# Altium project COMS0005_Coms_Test_Board.PrjPCB
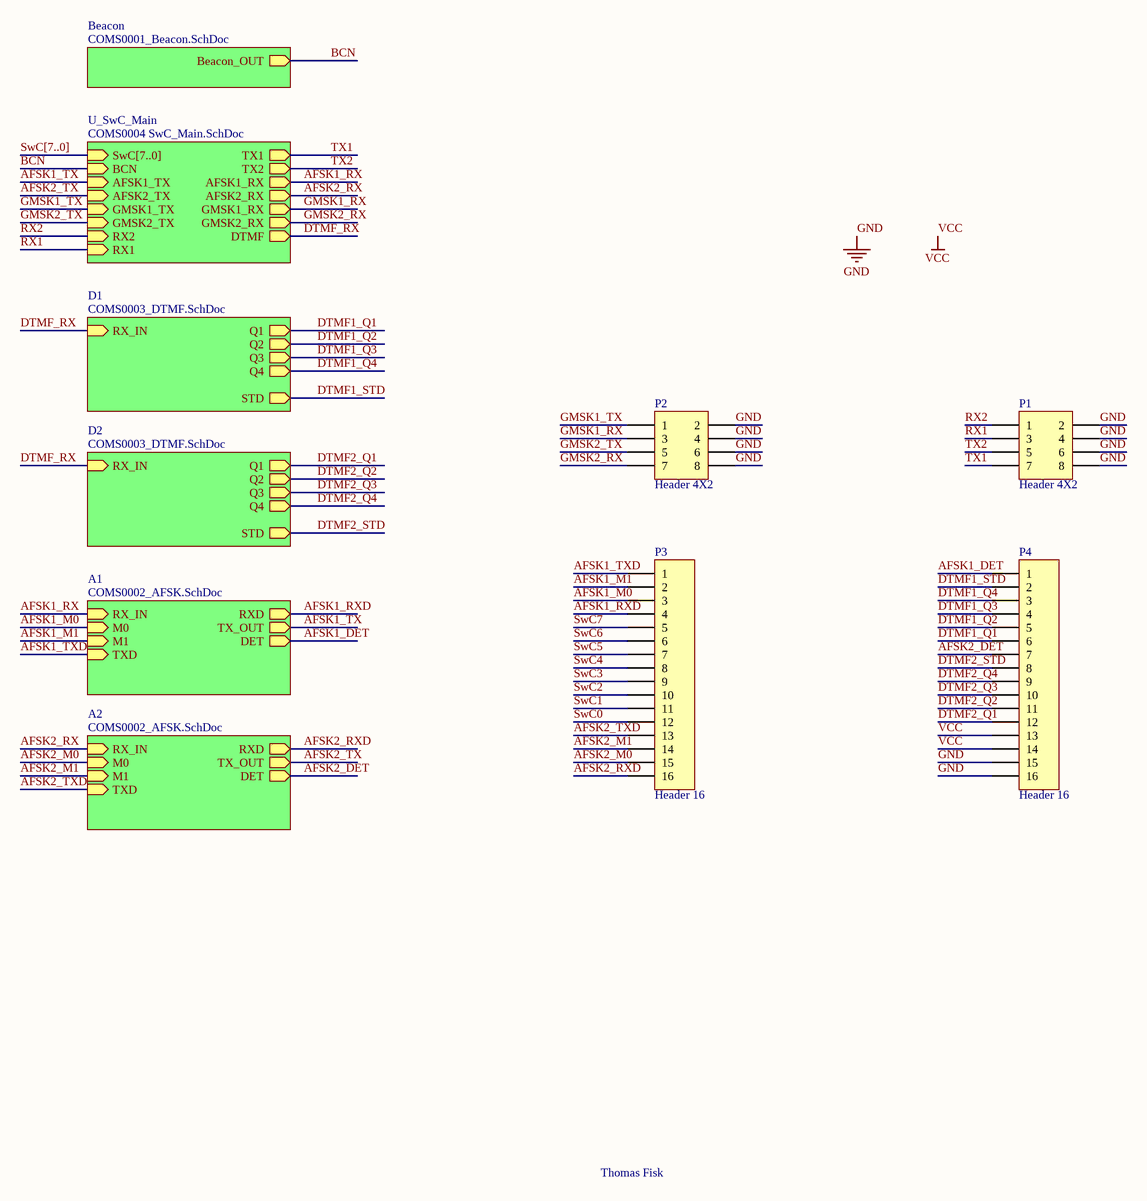
[diagram p0: COMS0010_Comms_Test_Board.SchDoc]
5 sheets, 60 parts. Net scope: hierarchical (ports join the sheet entries above them; power ports are global).
Sheets:
  COMS0010_Comms_Test_Board.SchDoc
    Beacon = COMS0001_Beacon.SchDoc
    U_SwC_Main = COMS0004 SwC_Main.SchDoc
    A1 = COMS0002_AFSK.SchDoc
    A2 = COMS0002_AFSK.SchDoc
    D1 = COMS0003_DTMF.SchDoc
    D2 = COMS0003_DTMF.SchDoc

## Sheet COMS0010_Comms_Test_Board.SchDoc: BLUEsat Communications Test Board
size A3; DrawnBy: Thomas Fisk; Engineer: T. FISK; Organization: BLUEsat Project; Address1: Room 419; Address2: School of EE&T; Address3: UNSW, NSW 2052; Address4: Australia; DocumentNumber: COMS0005; SheetNumber: 1; SheetTotal: 1; Description: Test board for communications subsystem.; Version: 1.0

### Parts
P1  Header 4X2  [HDR2X4]
P2  Header 4X2  [HDR2X4]
P3  Header 16  [HDR1X16]
P4  Header 16  [HDR1X16]

### Sub-sheets
A1 = COMS0002_AFSK.SchDoc: RX_IN (in), M0 (in), M1 (in), TXD (in), RXD (out), TX_OUT (out), DET (out)
A2 = COMS0002_AFSK.SchDoc: RX_IN (in), M0 (in), M1 (in), TXD (in), RXD (out), TX_OUT (out), DET (out)
Beacon = COMS0001_Beacon.SchDoc: Beacon_OUT (out)
D1 = COMS0003_DTMF.SchDoc: Q1 (out), RX_IN (in), STD (out), Q2 (out), Q3 (out), Q4 (out)
D2 = COMS0003_DTMF.SchDoc: Q1 (out), RX_IN (in), STD (out), Q2 (out), Q3 (out), Q4 (out)
U_SwC_Main = COMS0004 SwC_Main.SchDoc: SwC[7..0] (in), BCN (in), AFSK1_TX (in), AFSK2_TX (in), GMSK1_TX (in), GMSK2_TX (in), TX1 (out), TX2 (out), RX2 (in), RX1 (in), AFSK1_RX (out), AFSK2_RX (out), GMSK1_RX (out), GMSK2_RX (out), DTMF (out)

### Nets
GND: P1.2 P1.4 P1.6 P1.8 P2.2 P2.4 P2.6 P2.8 P4.15 P4.16
VCC: P4.13 P4.14
AFSK1_DET: P4.1 ; sheet A1/DET
AFSK1_M0: P3.3 ; sheet A1/M0
AFSK1_M1: P3.2 ; sheet A1/M1
AFSK1_RX: sheet U_SwC_Main/AFSK1_RX, sheet A1/RX_IN
AFSK1_RXD: P3.4 ; sheet A1/RXD
AFSK1_TX: sheet U_SwC_Main/AFSK1_TX, sheet A1/TX_OUT
AFSK1_TXD: P3.1 ; sheet A1/TXD
AFSK2_DET: P4.7 ; sheet A2/DET
AFSK2_M0: P3.15 ; sheet A2/M0
AFSK2_M1: P3.14 ; sheet A2/M1
AFSK2_RX: sheet U_SwC_Main/AFSK2_RX, sheet A2/RX_IN
AFSK2_RXD: P3.16 ; sheet A2/RXD
AFSK2_TX: sheet U_SwC_Main/AFSK2_TX, sheet A2/TX_OUT
AFSK2_TXD: P3.13 ; sheet A2/TXD
BCN: sheet Beacon/Beacon_OUT, sheet U_SwC_Main/BCN
DTMF1_Q1: P4.6 ; sheet D1/Q1
DTMF1_Q2: P4.5 ; sheet D1/Q2
DTMF1_Q3: P4.4 ; sheet D1/Q3
DTMF1_Q4: P4.3 ; sheet D1/Q4
DTMF1_STD: P4.2 ; sheet D1/STD
DTMF2_Q1: P4.12 ; sheet D2/Q1
DTMF2_Q2: P4.11 ; sheet D2/Q2
DTMF2_Q3: P4.10 ; sheet D2/Q3
DTMF2_Q4: P4.9 ; sheet D2/Q4
DTMF2_STD: P4.8 ; sheet D2/STD
DTMF_RX: sheet U_SwC_Main/DTMF, sheet D1/RX_IN, sheet D2/RX_IN
GMSK1_RX: P2.3 ; sheet U_SwC_Main/GMSK1_RX
GMSK1_TX: P2.1 ; sheet U_SwC_Main/GMSK1_TX
GMSK2_RX: P2.7 ; sheet U_SwC_Main/GMSK2_RX
GMSK2_TX: P2.5 ; sheet U_SwC_Main/GMSK2_TX
RX1: P1.3 ; sheet U_SwC_Main/RX1
RX2: P1.1 ; sheet U_SwC_Main/RX2
SwC0: P3.12
SwC1: P3.11
SwC2: P3.10
SwC3: P3.9
SwC4: P3.8
SwC5: P3.7
SwC6: P3.6
SwC7: P3.5
TX1: P1.7 ; sheet U_SwC_Main/TX1
TX2: P1.5 ; sheet U_SwC_Main/TX2

### Buses and harness runs
bus SwC[7..0] = sheet U_SwC_Main/SwC[7..0]

### Notes on the sheet
- Thomas Fisk
- Title
- Description:
- Size:
- Author:
- Date:
- A3
- Time:
- Version
- Sheet:
- Drawing No.:
- of
- File:

### Library data of the parts
P1 P2 = Header 4X2: Header, 4-Pin, Dual row; LatestRevisionDate: 17-Jul-2002; LatestRevisionNote: Re-released for DXP Platform.; Publisher: Altium Limited
P3 P4 = Header 16: Header, 16-Pin; LatestRevisionDate: 17-Jul-2002; LatestRevisionNote: Re-released for DXP Platform.; Publisher: Altium Limited

## Sheet COMS0001_Beacon.SchDoc: BLUEsat Beacon
size A3; Author: Daniel Jedrychowski; Engineer: D. JEDRYCHOWSKI; Organization: BLUEsat Project; Address1: Room 419; Address2: School of EE&T; Address3: UNSW, NSW 2052; Address4: Australia; DocumentNumber: COMS0001; SheetNumber: 1; SheetTotal: 1; Description: Morse code continuous wave beacon based on EPROM; Version: 1.1
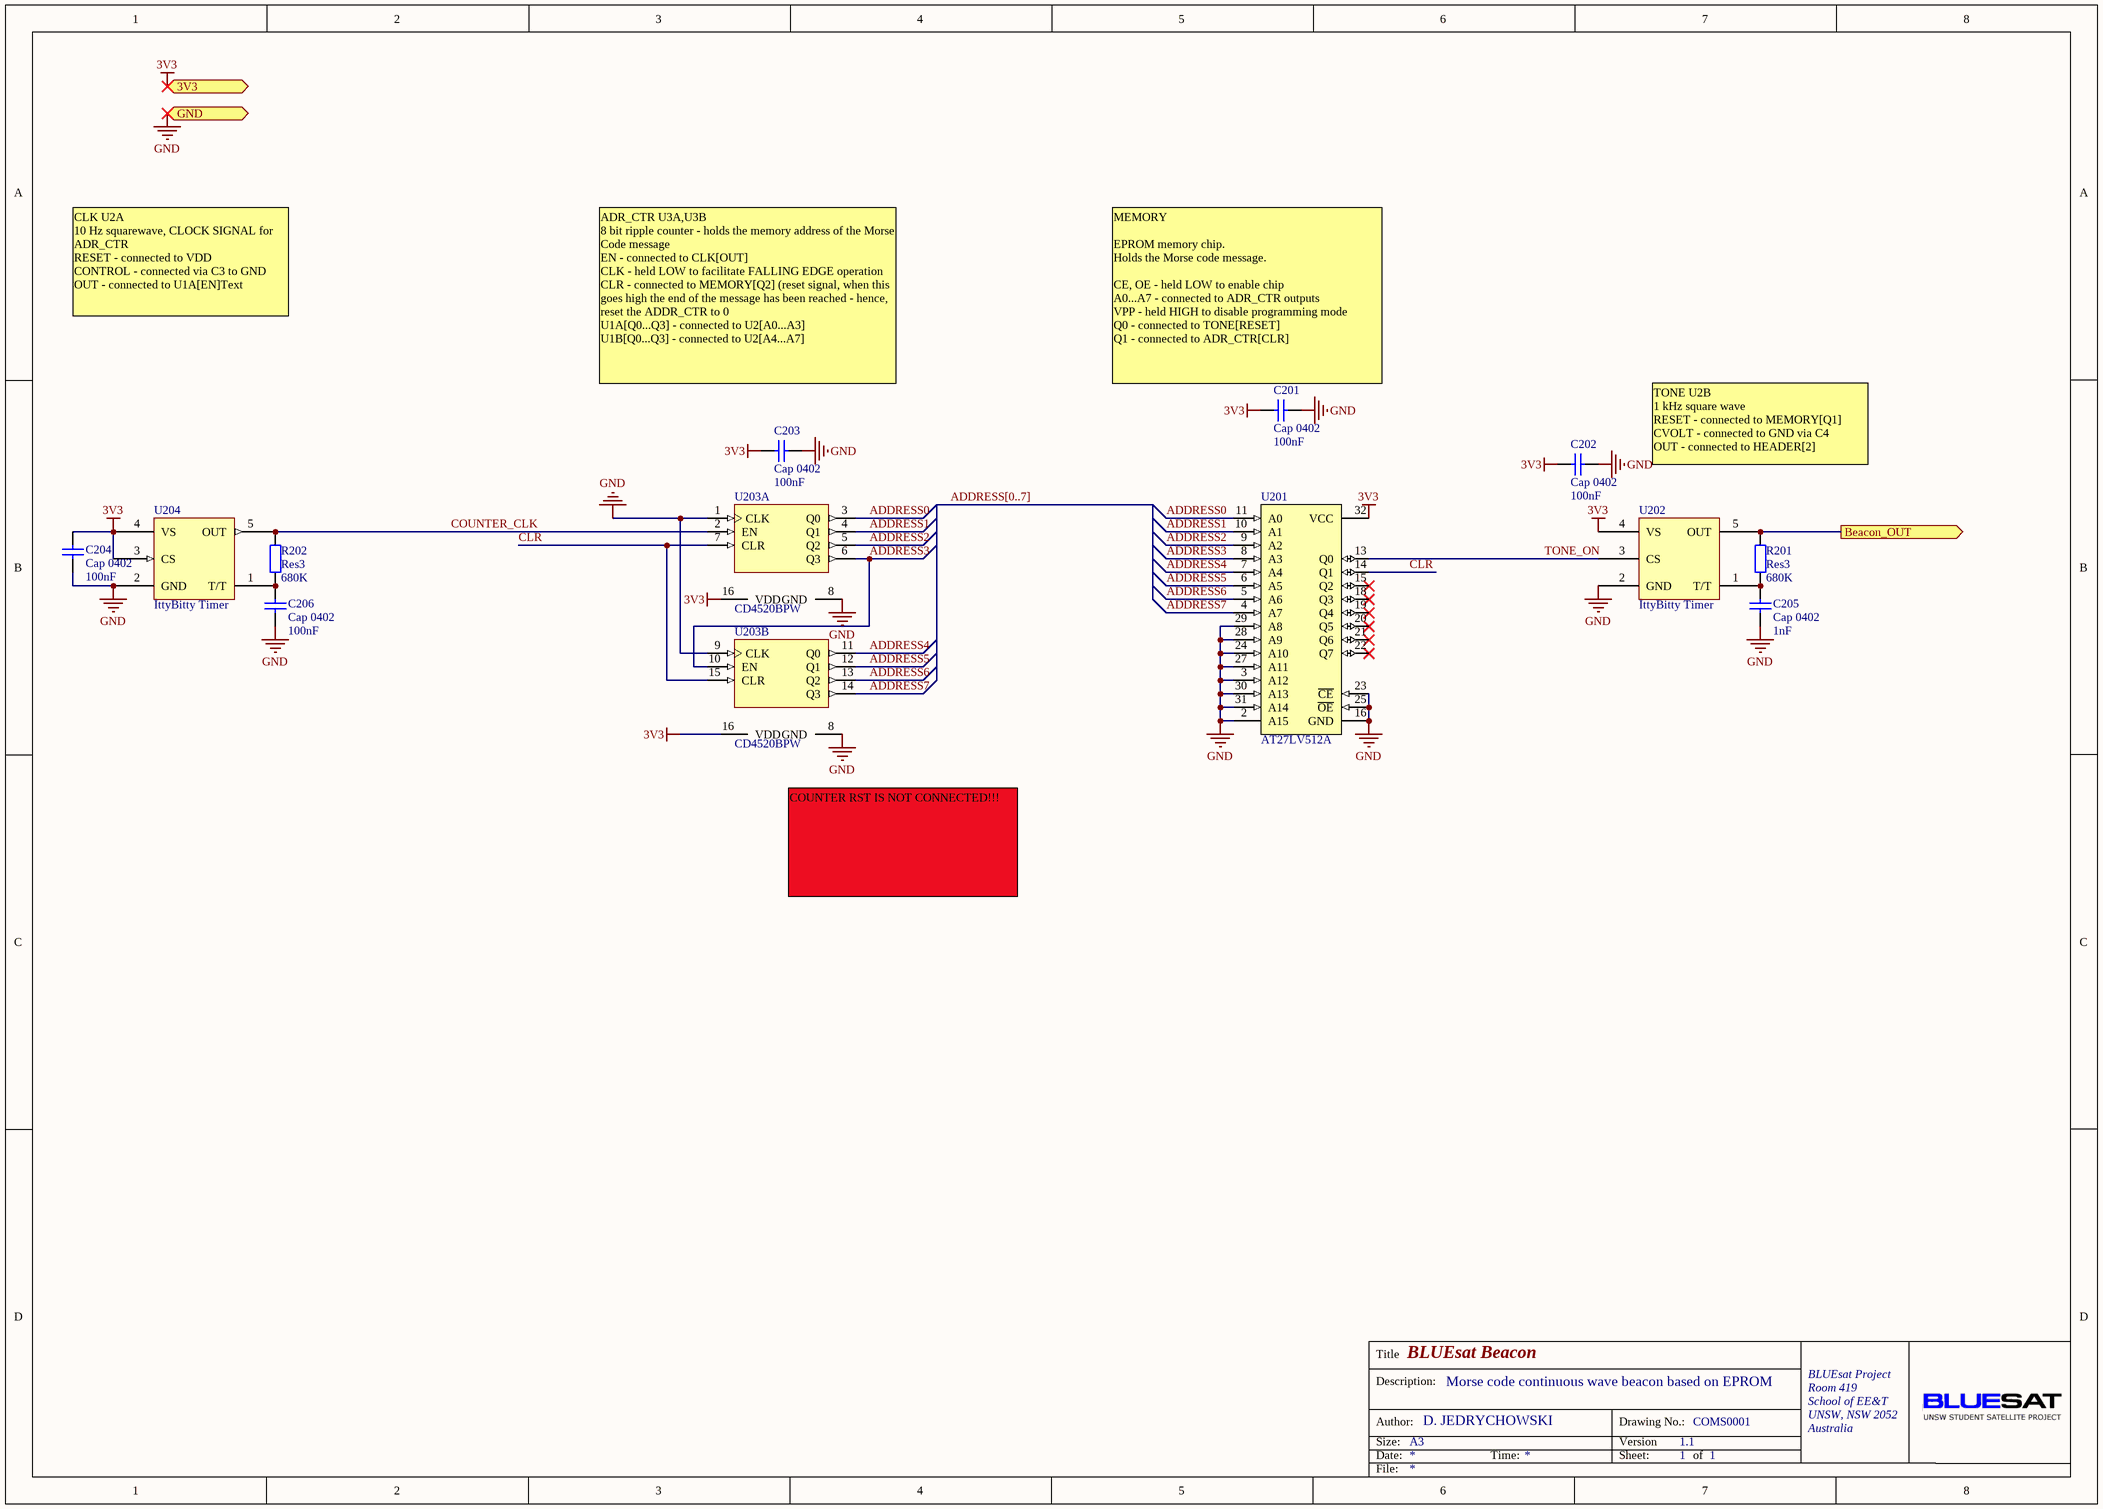
[diagram p1: COMS0001_Beacon.SchDoc]

### Parts
C201  Cap 0402  value 100nF  [CAPC1005X06L]
C202  Cap 0402  value 100nF  [CAPC1005X06L]
C203  Cap 0402  value 100nF  [CAPC1005X06L]
C204  Cap 0402  value 100nF  [CAPC1005X06L]
C205  Cap 0402  value 1nF  [CAPC1005X06L]
C206  Cap 0402  value 100nF  [CAPC1005X06L]
R201  Res3  value 680K  [RESC1005X06L]
R202  Res3  value 680K  [RESC1005X06L]
U201  AT27LV512A  [PLCC7*9]
U202  IttyBitty Timer  [SOT23-5]
U203  CD4520BPW  [TSSOP16]  (parts A,B of 2)
U204  IttyBitty Timer  [SOT23-5]

### Ports
3V3 (in), Beacon_OUT (out), GND (in)

### Nets
3V3: C201.1 C202.1 C203.1 C204.2 U201.32(VCC) U202.4(VS) U203.16(VDD) U204.3(CS) U204.4(VS) ; port 3V3
GND: C201.2 C202.2 C203.2 C204.1 C205.1 C206.1 U201.2(A15) U201.3(A12) U201.16(GND) U201.23(~{CE}) U201.24(A10) U201.25(~{OE}) U201.27(A11) U201.28(A9) U201.29(A8) U201.30(A13) U201.31(A14) U202.2(GND) U203.1(CLK) U203.8(GND) U203.9(CLK) U204.2(GND) ; port GND
ADDRESS0: U201.11(A0) U203.3(Q0)
ADDRESS1: U201.10(A1) U203.4(Q1)
ADDRESS2: U201.9(A2) U203.5(Q2)
ADDRESS3: U201.8(A3) U203.6(Q3) U203.10(EN)
ADDRESS4: U201.7(A4) U203.11(Q0)
ADDRESS5: U201.6(A5) U203.12(Q1)
ADDRESS6: U201.5(A6) U203.13(Q2)
ADDRESS7: U201.4(A7) U203.14(Q3)
BCN: R201.1 U202.5(OUT) ; port Beacon_OUT
CLR: U201.14(Q1) U203.7(CLR) U203.15(CLR)
COUNTER_CLK: R202.1 U203.2(EN) U204.5(OUT)
TONE_ON: U201.13(Q0) U202.3(CS)
NetC205_2: C205.2 R201.2 U202.1(T/T)
NetC206_2: C206.2 R202.2 U204.1(T/T)

Not connected (* = marked no-connect by the designer): U201 15(Q2)* 18(Q3)* 19(Q4)* 20(Q5)* 21(Q6)* 22(Q7)*

### Buses and harness runs
bus ADDRESS[0..7]

### Notes on the sheet
- CLK U2A
  10 Hz squarewave, CLOCK SIGNAL for ADR_CTR
  RESET - connected to VDD
  CONTROL - connected via C3 to GND
  OUT - connected to U1A[EN]Text
- ADR_CTR U3A,U3B
  8 bit ripple counter - holds the memory address of the Morse Code message
  EN - connected to CLK[OUT]
  CLK - held LOW to facilitate FALLING EDGE operation
  CLR - connected to MEMORY[Q2] (reset signal, when this goes high the end of the message has been reached - hence, reset the ADDR_CTR to 0
  U1A[Q0...Q3] - connected to U2[A0...A3]
  U1B[Q0...Q3] - connected to U2[A4...A7]
- (near C201) MEMORY
  EPROM memory chip.
  Holds the Morse code message.
  CE, OE - held LOW to enable chip
  A0...A7 - connected to ADR_CTR outputs
  VPP - held HIGH to disable programming mode
  Q0 - connected to TONE[RESET]
  Q1 - connected to ADR_CTR[CLR]
- TONE U2B
  1 kHz square wave
  RESET - connected to MEMORY[Q1]
  CVOLT - connected to GND via C4
  OUT - connected to HEADER[2]
- COUNTER RST IS NOT CONNECTED!!!
- Title
- Description:
- Size:
- Author:
- Date:
- A3
- Time:
- Version
- Sheet:
- Drawing No.:
- of
- File:

### Library data of the parts
C201-C206 = Cap 0402: Capacitor; Published: 8-Jun-2000; LatestRevisionDate: 17-Jul-2002; LatestRevisionNote: Re-released for DXP Platform.; PackageReference: RAD-0.3; Publisher: Altium Limited; PackageDescription: Radial Cap, Thru-Hole; 2 Leads; 0.3 in Pin Spacing
R201 R202 = Res3: Resistor; Published: 8-Jun-2000; LatestRevisionDate: 29-May-2009; LatestRevisionNote: IPC-7351 Footprint Added.; PackageReference: J1-0603; Publisher: Altium Limited; PackageDescription: Chip Resistor
U201 = AT27LV512A: 512 Kbit (32Kb X 8) UV EPROM and OTP EPROM; Published: 24-Aug-2001; LatestRevisionDate: 06-Jun-2005; LatestRevisionNote: Stylized 3D Model Added.; DatasheetVersion: Jul-1998; PackageVersion: Jan-2003; PackageReference: PDIP28; Publisher: Altium Limited; PackageDescription: DIP; 28 Leads; Row Spacing 15.24 mm; Pitch 2.54 mm; ComponentLink1Description: Manufacturer Link; ComponentLink1URL: http://www.st.com/; ComponentLink2Description: Datasheet; ComponentLink2URL: http://www.st.com/stonline/products/literature/ds/2384/m27c256b.pdf; Supplier 1: Digi-Key; Supplier Part Number 1: AT27LV256A-70RC-ND
U202 U204 = MIC1557: Miniature Astable Timer Chip; Supplier: Farnell; Supplier Part Number: 1517241
U203 = CD4520BPW: Dual Binary Up-Counter; Supplier 1: Farnell; Supplier Part Number 1: 1752815

## Sheet COMS0004 SwC_Main.SchDoc: BLUEsat Switching Circuit Overview
size A3; Engineer: D. JEDRYCHOWSKI; Organization: BLUEsat Project; Address1: Room 419; Address2: School of EE&T; Address3: UNSW, NSW 2052; Address4: Australia; DocumentNumber: COMS0004; SheetNumber: 1; SheetTotal: 4; Description: Overview of Switching Circuit; Version: 1.0
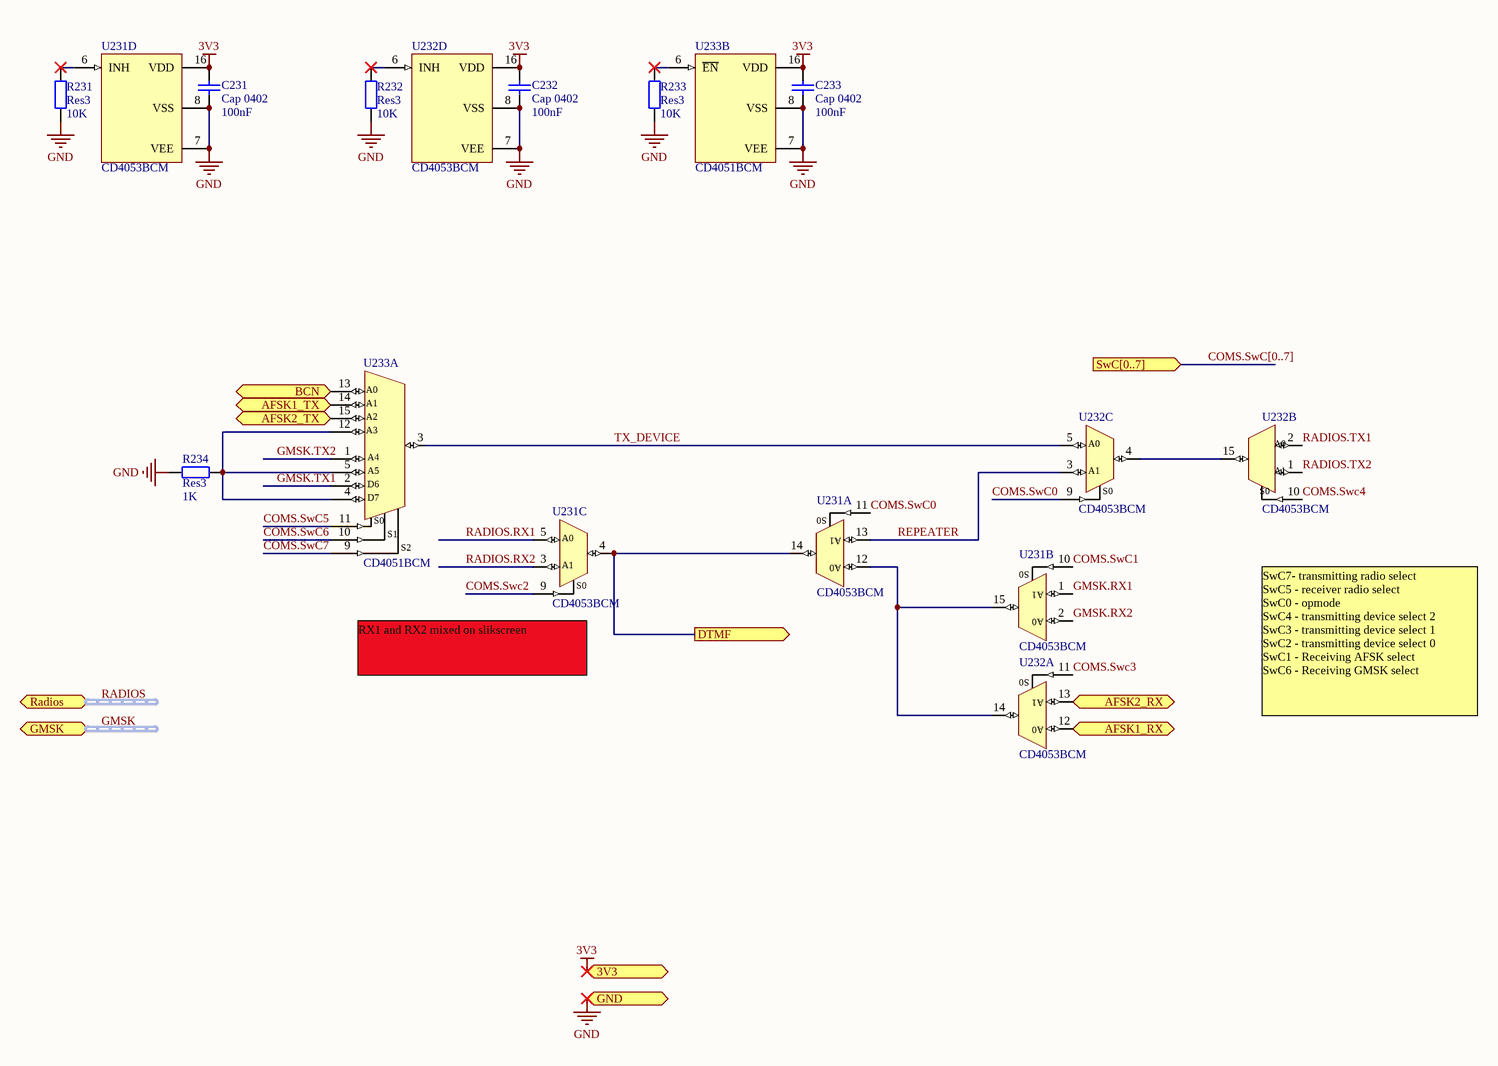
[diagram p2: COMS0004 SwC_Main.SchDoc]

### Parts
C231  Cap 0402  value 100nF  [CAPC1005X06L]
C232  Cap 0402  value 100nF  [CAPC1005X06L]
C233  Cap 0402  value 100nF  [CAPC1005X06L]
R231  Res3  value 10K  [RESC1005X06L]
R232  Res3  value 10K  [RESC1005X06L]
R233  Res3  value 10K  [RESC1005X06L]
R234  Res3  value 1K  [RESC1005X06L]
U231  CD4053BCM  [TSSOP16]  (parts A,B,C,D of 4)
U232  CD4053BCM  [TSSOP16]  (parts A,B,C,D of 4)
U233  CD4051BCM  [TSSOP16]  (parts A,B of 2)

### Ports
3V3 (in), AFSK1_RX (out), AFSK1_TX (in), AFSK2_RX (out), AFSK2_TX (in), BCN (in), DTMF (out), GMSK (harness GMSK), GND (in), Radios (harness RADIOS), SwC[0..7] (in)

### Nets
3V3: C231.2 C232.2 C233.2 U231.16(VDD) U232.16(VDD) U233.16(VDD) ; port 3V3
GND: C231.1 C232.1 C233.1 R231.2 R232.2 R233.2 R234.1 U231.7(VEE) U231.8(VSS) U232.7(VEE) U232.8(VSS) U233.7(VEE) U233.8(VSS) ; port GND
AFSK1_RX: U232.12(A0) ; port AFSK1_RX
AFSK1_TX: U233.14(A1) ; port AFSK1_TX
AFSK2_RX: U232.13(A1) ; port AFSK2_RX
AFSK2_TX: U233.15(A2) ; port AFSK2_TX
BCN: U233.13(A0) ; port BCN
COMS.SwC0: U231.11(A) U232.9(C)
COMS.SwC1: U231.10(B)
COMS.Swc2: U231.9(C)
COMS.Swc3: U232.11(A)
COMS.Swc4: U232.10(B)
COMS.SwC5: U233.11(S0)
COMS.SwC6: U233.10(S1)
COMS.SwC7: U233.9(S2)
DTMF_RX: U231.4(c_out) U231.14(A_out) ; port DTMF
GMSK.RX1: U231.1(by)
GMSK.RX2: U231.2(bx)
GMSK.TX1: U233.2(A6)
GMSK.TX2: U233.1(A4)
RADIOS.RX1: U231.5(cx)
RADIOS.RX2: U231.3(cy)
RADIOS.TX1: U232.2(bx)
RADIOS.TX2: U232.1(by)
REPEATER: U231.13(A1) U232.3(cy)
TX_DEVICE: U232.5(cx) U233.3(O)
NetR231_1: R231.1 U231.6(INH)
NetR232_1: R232.1 U232.6(INH)
NetR233_1: R233.1 U233.6(~{EN})
NetR234_2: R234.2 U233.4(A7) U233.5(A5) U233.12(A3)
NetU231_12: U231.12(A0) U231.15(b_out) U232.14(A_out)
NetU232_4: U232.4(c_out) U232.15(b_out)

### Buses and harness runs
bus COMS.SwC[0..7] = port SwC[0..7]
harness GMSK = port GMSK
harness RADIOS = port Radios

### Notes on the sheet
- (near U231) RX1 and RX2 mixed on slikscreen
- SwC7- transmitting radio select
  SwC5 - receiver radio select
  SwC0 - opmode
  SwC4 - transmitting device select 2
  SwC3 - transmitting device select 1
  SwC2 - transmitting device select 0
  SwC1 - Receiving AFSK select
  SwC6 - Receiving GMSK select
- Title
- Description:
- Size:
- Author:
- Date:
- A3
- Time:
- Version
- Sheet:
- Drawing No.:
- of
- File:
- (in symbol CD4051BCM, part A) D6; D7
- (in symbol CD4053BCM, part A) S0
- (in symbol CD4053BCM, part B) S0
- (in symbol CD4053BCM, part C) S0

### Library data of the parts
C231-C233 = Cap 0402: Capacitor; Published: 8-Jun-2000; LatestRevisionDate: 17-Jul-2002; LatestRevisionNote: Re-released for DXP Platform.; PackageReference: RAD-0.3; Publisher: Altium Limited; PackageDescription: Radial Cap, Thru-Hole; 2 Leads; 0.3 in Pin Spacing
R231-R234 = Res3: Resistor; Published: 8-Jun-2000; LatestRevisionDate: 29-May-2009; LatestRevisionNote: IPC-7351 Footprint Added.; PackageReference: J1-0603; Publisher: Altium Limited; PackageDescription: Chip Resistor
U231 U232 = CD4053BCM: Triple 2-Channnel Analog Multiplexer/Demutiplexer; Supplier 1: Farnell; Supplier Part Number 1: 2132284
U233 = CD4051BCM: 8-Channel Analog Multiplexer/Demultiplexer; Datasheet Link: http://focus.ti.com/lit/ds/symlink/cd4052b.pdf; Supplier 1: Farnell; Supplier Part Number 1: 1753421

## Sheet COMS0002_AFSK.SchDoc: BLUEsat AFSK Modem
size A3; DrawnBy: Mitch Wenke, Chris Webb, Thomas Fisk; Engineer: C. WEBB, M. WENKE; Organization: BLUEsat Project; Address1: Room 419; Address2: School of EE&T; Address3: UNSW, NSW 2052; Address4: Australia; DocumentNumber: COMS0002; SheetNumber: 1; SheetTotal: 1; Description: AFSK modem based on CML MX614 IC; Version: 1.0
Used 2 times, as channels A1, A2. Parts and nets are listed once, with the designators drawn on the sheet.
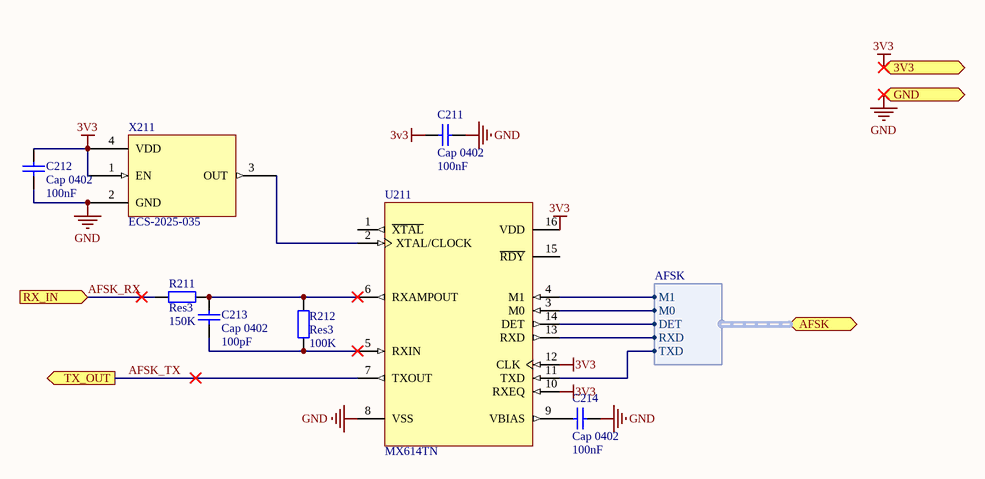
[diagram p3: COMS0002_AFSK.SchDoc]

### Parts
C211  Cap 0402  value 100nF  [CAPC1005X06L]
C212  Cap 0402  value 100nF  [CAPC1005X06L]
C213  Cap 0402  value 100pF  [CAPC1005X06L]
C214  Cap 0402  value 100nF  [CAPC1005X06L]
R211  Res3  value 150K  [RESC1005X06L]
R212  Res3  value 100K  [RESC1005X06L]
U211  MX614TN  [SOIC16]
X211  ECS-2025-035  [ECS-2025]

### Ports
3V3 (in), AFSK (harness AFSK), GND (in), RX_IN (in), TX_OUT (out)

### Harnesses
AFSK: DET, M0, M1, RXD, TXD

### Nets
3V3: C211.2 C212.2 U211.10(RXEQ) U211.12(CLK) U211.16(VDD) X211.1(EN) X211.4(VDD) ; port 3V3
GND: C211.1 C212.1 C214.1 U211.8(VSS) X211.2(GND) ; port GND
AFSK_RX: R211.2 ; port RX_IN
AFSK_TX: U211.7(TXOUT) ; port TX_OUT
NetC213_1: C213.1 R212.2 U211.5(RXIN)
NetC213_2: C213.2 R211.1 R212.1 U211.6(RXAMPOUT)
NetC214_2: C214.2 U211.9(VBIAS)
NetU211_2: U211.2(XTAL/CLOCK) X211.3(OUT)
NetU211_3: U211.3(M0) ; port AFSK.M0
NetU211_4: U211.4(M1) ; port AFSK.M1
NetU211_11: U211.11(TXD) ; port AFSK.TXD
NetU211_13: U211.13(RXD) ; port AFSK.RXD
NetU211_14: U211.14(DET) ; port AFSK.DET

Not connected (* = marked no-connect by the designer): U211 1(~{XTAL}) 15(~{RDY})

### Channels
A1: designators end in _A1; ports 3V3=3V3 GND=GND RX_IN=AFSK1_RX TX_OUT=AFSK1_TX
A2: designators end in _A2; ports 3V3=3V3 GND=GND RX_IN=AFSK2_RX TX_OUT=AFSK2_TX

### Notes on the sheet
- Title
- Description:
- Size:
- Author:
- Date:
- A3
- Time:
- Version
- Sheet:
- Drawing No.:
- of
- File:

### Library data of the parts
C211-C214 = Cap 0402: Capacitor; Published: 8-Jun-2000; LatestRevisionDate: 17-Jul-2002; LatestRevisionNote: Re-released for DXP Platform.; PackageReference: RAD-0.3; Publisher: Altium Limited; PackageDescription: Radial Cap, Thru-Hole; 2 Leads; 0.3 in Pin Spacing
R211 R212 = Res3: Resistor; Published: 8-Jun-2000; LatestRevisionDate: 29-May-2009; LatestRevisionNote: IPC-7351 Footprint Added.; PackageReference: J1-0603; Publisher: Altium Limited; PackageDescription: Chip Resistor
U211 = MX614TN: Bell 202 Compatible Modem
X211 = ECS-2025-035: SMD Clock Oscillator, 3.579545MHz

## Sheet COMS0003_DTMF.SchDoc: BLUEsat DTMF receiver
size A3; DrawnBy: Thomas Fisk; Engineer: T. FISK; Organization: BLUEsat Project; Address1: Room 419; Address2: School of EE&T; Address3: UNSW, NSW 2052; Address4: Australia; DocumentNumber: COMS0003; SheetNumber: 1; SheetTotal: 1; Description: DTMF decoder for telecommand interface; Version: 1.0
Used 2 times, as channels D1, D2. Parts and nets are listed once, with the designators drawn on the sheet.
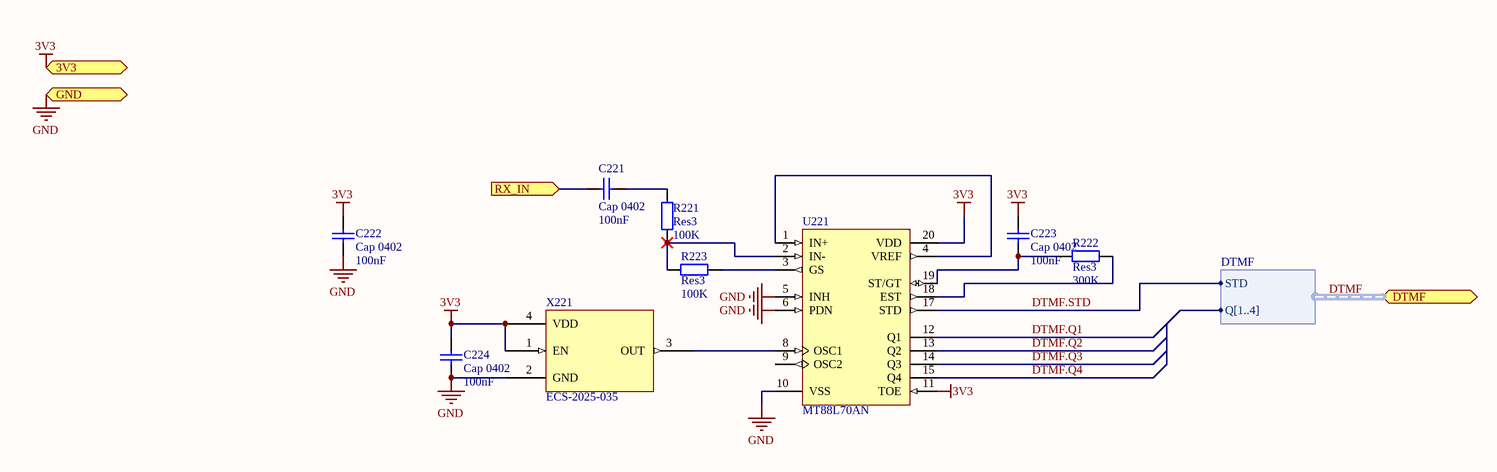
[diagram p4: COMS0003_DTMF.SchDoc]

### Parts
C221  Cap 0402  value 100nF  [CAPC1005X06L]
C222  Cap 0402  value 100nF  [CAPC1005X06L]
C223  Cap 0402  value 100nF  [CAPC1005X06L]
C224  Cap 0402  value 100nF  [CAPC1005X06L]
R221  Res3  value 100K  [RESC1005X06L]
R222  Res3  value 300K  [RESC1005X06L]
R223  Res3  value 100K  [RESC1005X06L]
U221  MT88L70AN  [TSSOP20]
X221  ECS-2025-035  [ECS-2025]

### Ports
3V3 (in), DTMF (harness DTMF), GND (in), RX_IN (in)

### Harnesses
DTMF: STD, Q[1..4]

### Nets
3V3: C222.2 C223.1 C224.1 U221.11(TOE) U221.20(VDD) X221.1(EN) X221.4(VDD) ; port 3V3
GND: C222.1 C224.2 U221.5(INH) U221.6(PDN) U221.10(VSS) X221.2(GND) ; port GND
DTMF.Q1: U221.12(Q1)
DTMF.Q2: U221.13(Q2)
DTMF.Q3: U221.14(Q3)
DTMF.Q4: U221.15(Q4)
DTMF.STD: U221.17(STD) ; port DTMF.STD
RX_IN: C221.2 ; port RX_IN
NetC221_1: C221.1 R221.1
NetC223_2: C223.2 R222.1 U221.19(ST/GT)
NetR221_2: R221.2 R223.1 U221.2(IN-)
NetR222_2: R222.2 U221.18(EST)
NetR223_2: R223.2 U221.3(GS)
NetU221_1: U221.1(IN+) U221.4(VREF)
NetU221_8: U221.8(OSC1) X221.3(OUT)

Not connected (* = marked no-connect by the designer): U221 9(OSC2)

### Channels
D1: designators end in _D1; ports 3V3=3V3 GND=GND RX_IN=DTMF_RX
D2: designators end in _D2; ports 3V3=3V3 GND=GND RX_IN=DTMF_RX

### Buses and harness runs
harness DTMF = port DTMF

### Notes on the sheet
- Title
- Description:
- Size:
- Author:
- Date:
- A3
- Time:
- Version
- Sheet:
- Drawing No.:
- of
- File:

### Library data of the parts
C221-C224 = Cap 0402: Capacitor; Published: 8-Jun-2000; LatestRevisionDate: 17-Jul-2002; LatestRevisionNote: Re-released for DXP Platform.; PackageReference: RAD-0.3; Publisher: Altium Limited; PackageDescription: Radial Cap, Thru-Hole; 2 Leads; 0.3 in Pin Spacing
R221-R223 = Res3: Resistor; Published: 8-Jun-2000; LatestRevisionDate: 29-May-2009; LatestRevisionNote: IPC-7351 Footprint Added.; PackageReference: J1-0603; Publisher: Altium Limited; PackageDescription: Chip Resistor
U221 = MT88L70AN: 3 Volt Integrated DTMF Receiver; Published: 8-Jun-2000; LatestRevisionDate: 13-Apr-2006; LatestRevisionNote: IPC-7351 Footprint Added.; DatasheetVersion: Issue 4 March 1997; PackageVersion: 1997; PackageReference: SOIC18; Publisher: Altium Limited; PackageDescription: 18-Pin Small Outline Integrated Circuit 1.27 mm Pitch; Code_JEDEC: MS-013-AB; ComponentLink1Description: Manufacturer Link; ComponentLink1URL: http://products.zarlink.com; ComponentLink2Description: Datasheet; ComponentLink2URL: http://assets.zarlink.com/DS/zarlink_MT88L70_MAY_05.pdf; Supplier 1: Allied; Supplier Part Number 1: 090-SPEC
X221 = ECS-2025-035: SMD Clock Oscillator, 3.579545MHz

## Nets that join several sheets
3V3: COMS0001_Beacon (9 pins), COMS0004 SwC_Main (6 pins), A1 (7 pins), A2 (7 pins), D1 (7 pins), D2 (7 pins)
GND: COMS0010_Comms_Test_Board (10 pins), COMS0001_Beacon (22 pins), COMS0004 SwC_Main (13 pins), A1 (5 pins), A2 (5 pins), D1 (6 pins), D2 (6 pins)
AFSK1_RX: COMS0004 SwC_Main (U232.12), A1 (R211_A1.2)
AFSK1_TX: COMS0004 SwC_Main (U233.14), A1 (U211_A1.7)
AFSK2_RX: COMS0004 SwC_Main (U232.13), A2 (R211_A2.2)
AFSK2_TX: COMS0004 SwC_Main (U233.15), A2 (U211_A2.7)
BCN: COMS0001_Beacon (R201.1 U202.5), COMS0004 SwC_Main (U233.13)
DTMF_RX: COMS0004 SwC_Main (U231.4 U231.14), D1 (C221_D1.2), D2 (C221_D2.2)